# Altium schematic sheet Logic_Analyzer.SchDoc
size A4; SheetNumber: 1; SheetTotal: 1
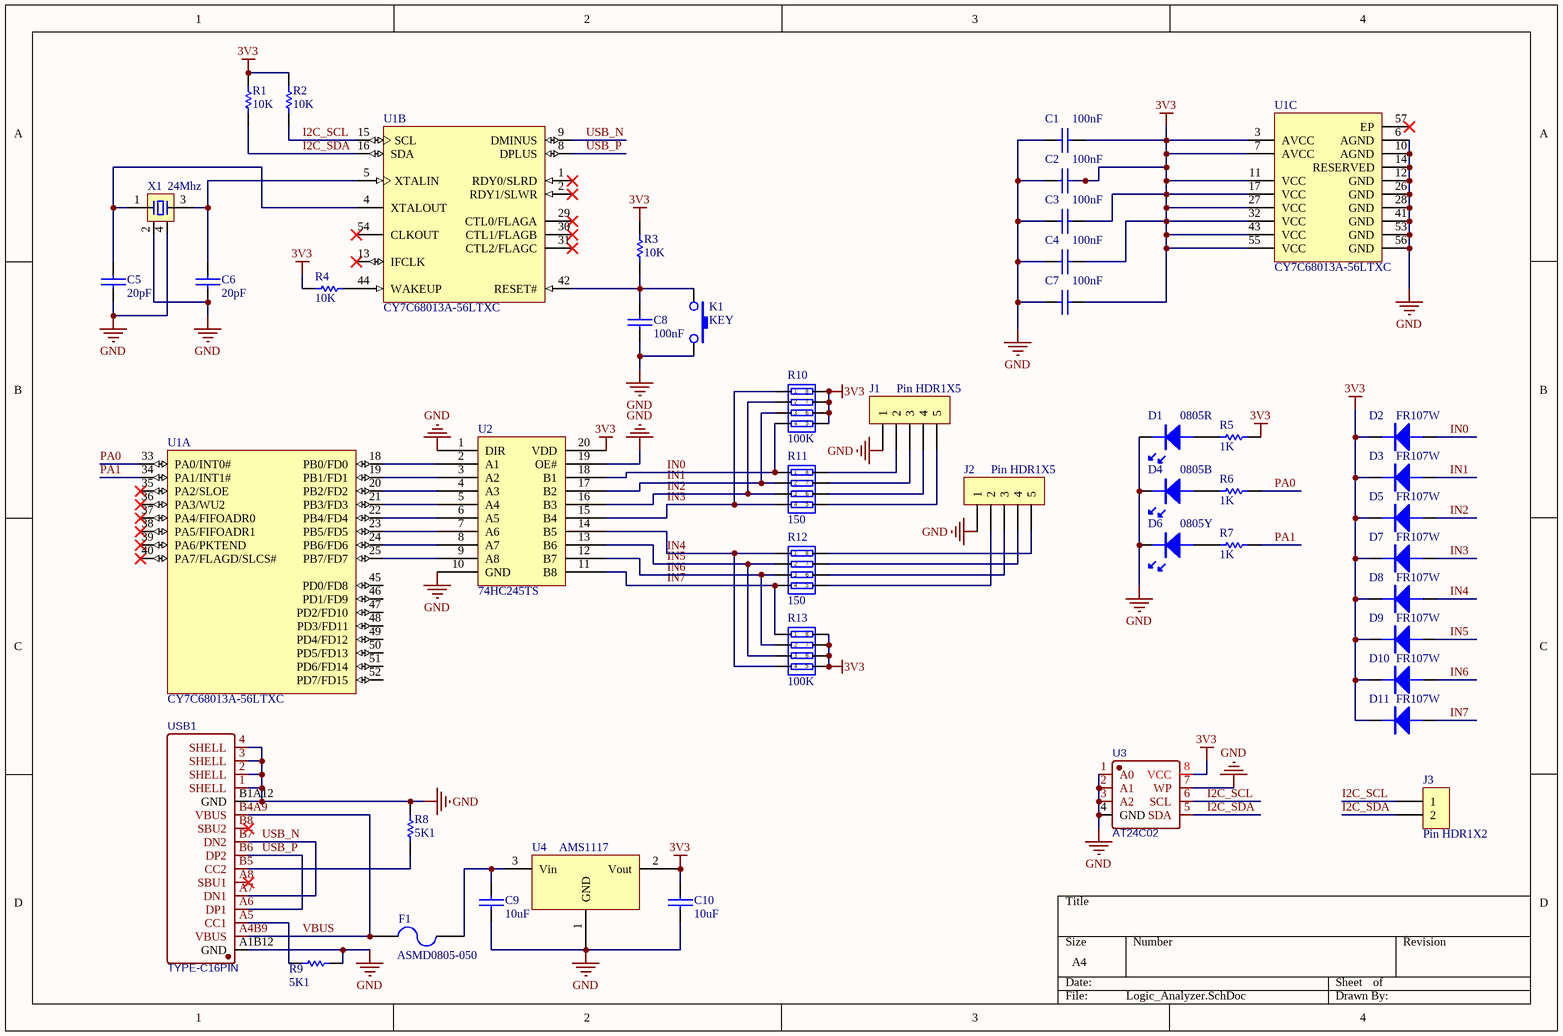
[diagram p0: Logic_Analyzer.SchDoc]

## Parts
C1  100nF  [0603C]
C2  100nF  [0603C]
C3  100nF  [0603C]
C4  100nF  [0603C]
C5  20pF  [0603C]
C6  20pF  [0603C]
C7  100nF  [0603C]
C8  100nF  [0603C]
C9  10uF  [0603C]
C10  10uF  [0603C]
D1  0805R  [LED-0805R]
D2  FR107W  [SOD-123]
D3  FR107W  [SOD-123]
D4  0805B  [LED-0805B]
D5  FR107W  [SOD-123]
D6  0805Y  [LED-0805Y]
D7  FR107W  [SOD-123]
D8  FR107W  [SOD-123]
D9  FR107W  [SOD-123]
D10  FR107W  [SOD-123]
D11  FR107W  [SOD-123]
F1  ASMD0805-050  [FUSE-0805]
J1  Pin HDR1X5  [Pin HDR1X5/2.54mm-S-SMD]
J2  Pin HDR1X5  [Pin HDR1X5/2.54mm-S-SMD]
J3  Pin HDR1X2  [Pin HDR1X2/2.54mm-S]
K1  KEY  [SW-SMD_L4.0-W2.9-P4.15-EH]
R1  10K  [0603R]
R2  10K  [0603R]
R3  10K  [0603R]
R4  10K  [0603R]
R5  1K  [0603R]
R6  1K  [0603R]
R7  1K  [0603R]
R8  5K1  [0603R]
R9  5K1  [0603R]
R10  100K  [RES-ARRAY-SMD_0603-8P-L3.2-W1.6-BL]
R11  150  [RES-ARRAY-SMD_0603-8P-L3.2-W1.6-BL]
R12  150  [RES-ARRAY-SMD_0603-8P-L3.2-W1.6-BL]
R13  100K  [RES-ARRAY-SMD_0603-8P-L3.2-W1.6-BL]
U1  CY7C68013A-56LTXC  [CYP-LTX56-5200X4500TP_M]  (parts A,B,C of 3)
U2  74HC245TS  [TSSOP20]
U3  AT24C02  [SOP8]
U4  AMS1117  [SOT223]
USB1  TYPE-C16PIN  [USB-C-SMD_TYPE-C16PIN]
X1  24Mhz  [OSC 3225-4P]

## Nets
3V3: C1.1 C2.1 C3.1 C4.1 C7.1 C10.2 D2.K D3.K D5.K D7.K D8.K D9.K D10.K D11.K R1.2 R2.2 R3.2 R4.2 R5.1 R10.5 R10.6 R10.7 R10.8 R13.5 R13.6 R13.7 R13.8 U1.3(AVCC) U1.7(AVCC) U1.11(VCC) U1.17(VCC) U1.27(VCC) U1.32(VCC) U1.43(VCC) U1.55(VCC) U2.20(VDD) U3.8(VCC) U4.2(Vout)
GND: C1.2 C2.2 C3.2 C4.2 C5.1 C6.1 C7.2 C8.1 C9.1 C10.1 D1.K D4.K D6.K J1.1 J2.1 K1.3 R8.1 R9.1 U1.6(AGND) U1.10(AGND) U1.12(GND) U1.14(RESERVED) U1.26(GND) U1.28(GND) U1.41(GND) U1.53(GND) U1.56(GND) U2.1(DIR) U2.10(GND) U2.19(OE#) U3.1(A0) U3.2(A1) U3.3(A2) U3.4(GND) U3.7(WP) U4.1(GND) USB1.1(SHELL) USB1.2(SHELL) USB1.3(SHELL) USB1.4(SHELL) USB1.A1B12(GND) USB1.B1A12(GND) X1.2 X1.4
I2C_SCL: J3.1 R2.1 U1.15(SCL) U3.6(SCL)
I2C_SDA: J3.2 R1.1 U1.16(SDA) U3.5(SDA)
IN0: D2.A R10.4 R11.1 U2.18(B1)
IN1: D3.A R10.3 R11.2 U2.17(B2)
IN2: D5.A R10.2 R11.3 U2.16(B3)
IN3: D7.A R10.1 R11.4 U2.15(B4)
IN4: D8.A R12.1 R13.4 U2.14(B5)
IN5: D9.A R12.2 R13.3 U2.13(B6)
IN6: D10.A R12.3 R13.2 U2.12(B7)
IN7: D11.A R12.4 R13.1 U2.11(B8)
PA0: R6.1 U1.33(PA0/INT0#)
PA1: R7.1 U1.34(PA1/INT1#)
USB_N: U1.9(DMINUS) USB1.A7(DN1) USB1.B7(DN2)
USB_P: U1.8(DPLUS) USB1.A6(DP1) USB1.B6(DP2)
VBUS: F1.1 USB1.A4B9(VBUS) USB1.B4A9(VBUS)
NetC5_2: C5.2 U1.4(XTALOUT) X1.1
NetC6_2: C6.2 U1.5(XTALIN) X1.3
NetC8_2: C8.2 K1.1 R3.1 U1.42(RESET#)
NetC9_2: C9.2 F1.2 U4.3(Vin)
NetD1_A: D1.A R5.2
NetD4_A: D4.A R6.2
NetD6_A: D6.A R7.2
NetJ1_2: J1.2 R11.8
NetJ1_3: J1.3 R11.7
NetJ1_4: J1.4 R11.6
NetJ1_5: J1.5 R11.5
NetJ2_2: J2.2 R12.5
NetJ2_3: J2.3 R12.6
NetJ2_4: J2.4 R12.7
NetJ2_5: J2.5 R12.8
NetR4_1: R4.1 U1.44(WAKEUP)
NetR8_2: R8.2 USB1.B5(CC2)
NetR9_2: R9.2 USB1.A5(CC1)
NetU1_18: U1.18(PB0/FD0) U2.2(A1)
NetU1_19: U1.19(PB1/FD1) U2.3(A2)
NetU1_20: U1.20(PB2/FD2) U2.4(A3)
NetU1_21: U1.21(PB3/FD3) U2.5(A4)
NetU1_22: U1.22(PB4/FD4) U2.6(A5)
NetU1_23: U1.23(PB5/FD5) U2.7(A6)
NetU1_24: U1.24(PB6/FD6) U2.8(A7)
NetU1_25: U1.25(PB7/FD7) U2.9(A8)

Not connected (* = marked no-connect by the designer): U1 1(RDY0/SLRD)* 2(RDY1/SLWR)* 13(IFCLK)* 29(CTL0/FLAGA)* 30(CTL1/FLAGB)* 31(CTL2/FLAGC)* 35(PA2/SLOE)* 36(PA3/WU2)* 37(PA4/FIFOADR0)* 38(PA5/FIFOADR1)* 39(PA6/PKTEND)* 40(PA7/FLAGD/SLCS#)* 45(PD0/FD8) 46(PD1/FD9) 47(PD2/FD10) 48(PD3/FD11) 49(PD4/FD12) 50(PD5/FD13) 51(PD6/FD14) 52(PD7/FD15) 54(CLKOUT)* 57(EP)*; USB1 A8(SBU1)* B8(SBU2)*

## Library data of the parts
C1-C10 = CAP: 无极性电容
D1 D4 D6 = LED
D2 D3 D5 D7-D11 = DIODE: 普通二极管
F1 = FUSE
R1-R9 = RES
R10-R13 = RES_ARRAY*4: 网络排阻4R
U1 = CY7C68013A-56LTXC: EZ-USB(R) FX2LP(TM) USB Microcontroller High-Speed USB Peripheral Controller, 16 KB, 24 I/Os, 3 to 3.6 V, 0 to 70 degC, 56-Pin QFN (LTX56), Tray; Manufacturer: Cypress; Max. Operating Voltage (V): 3.6; Memory Architecture: RAM; Memory Size (KB): 16; Min. Operating Voltage (V): 3; No. of I/Os: 24; DatasheetVersion: Rev. *W; PackageVersion: Rev. *D; PackageReference: LTX56; PackageDescription: 56-Pin Sawn QFN, Body 8 x 8 mm, Pitch 0.5 mm; Supplier 1: Digi-Key; Supplier Part Number 1: 428-2933-ND; Supplier 2: Newark; Supplier Part Number 2: 50R9455; Supplier 3: Mouser; Supplier Part Number 3: 727-CY7C68013A56LTXC; CPU Core: Enhanced 8051; Max. Operating Temp. (degreesC): 70; Min. Operating Temp. (degreesC): 0; Packing: Tray; RoHS: Pb-Free; Mounting Technology: Surface Mount; Code_JEDEC: MO-220; PartNumber: CY7C68013A-56LTXC; ComponentLink1Description: Manufacturer URL; ComponentLink1URL: http://www.cypress.com/; ComponentLink2Description: Datasheet; ComponentLink2URL: http://www.cypress.com/?docID=45142; ComponentLink3Description: Package Specification; ComponentLink3URL: http://www.cypress.com/?docID=47572
U3 = AT24C02: BOM_Manufacturer: IDCHIP; Contributor: LCSC; BOM_Supplier: LCSC; BOM_Supplier Part: C688857; BOM_Manufacturer Part: AT24C02; BOM_JLCPCB Part Class: Extended Part; spicePre: U; spiceSymbolName: AT24C02
U4 = AMS1117: 三端稳压芯片
USB1 = USB-C_16PIN: BOM_Manufacturer: SHOU HAN; Contributor: LCSC; BOM_Supplier: LCSC; BOM_Supplier Part: C393939; BOM_Manufacturer Part: TYPE-C16PIN; BOM_JLCPCB Part Class: Extended Part; spicePre: U; spiceSymbolName: TYPE-C16PIN
X1 = XTAL-4P: 4脚无源晶振